# EAGLE design H3BR20 (EAGLE 9.6.2)

## Sheet 1 of 2
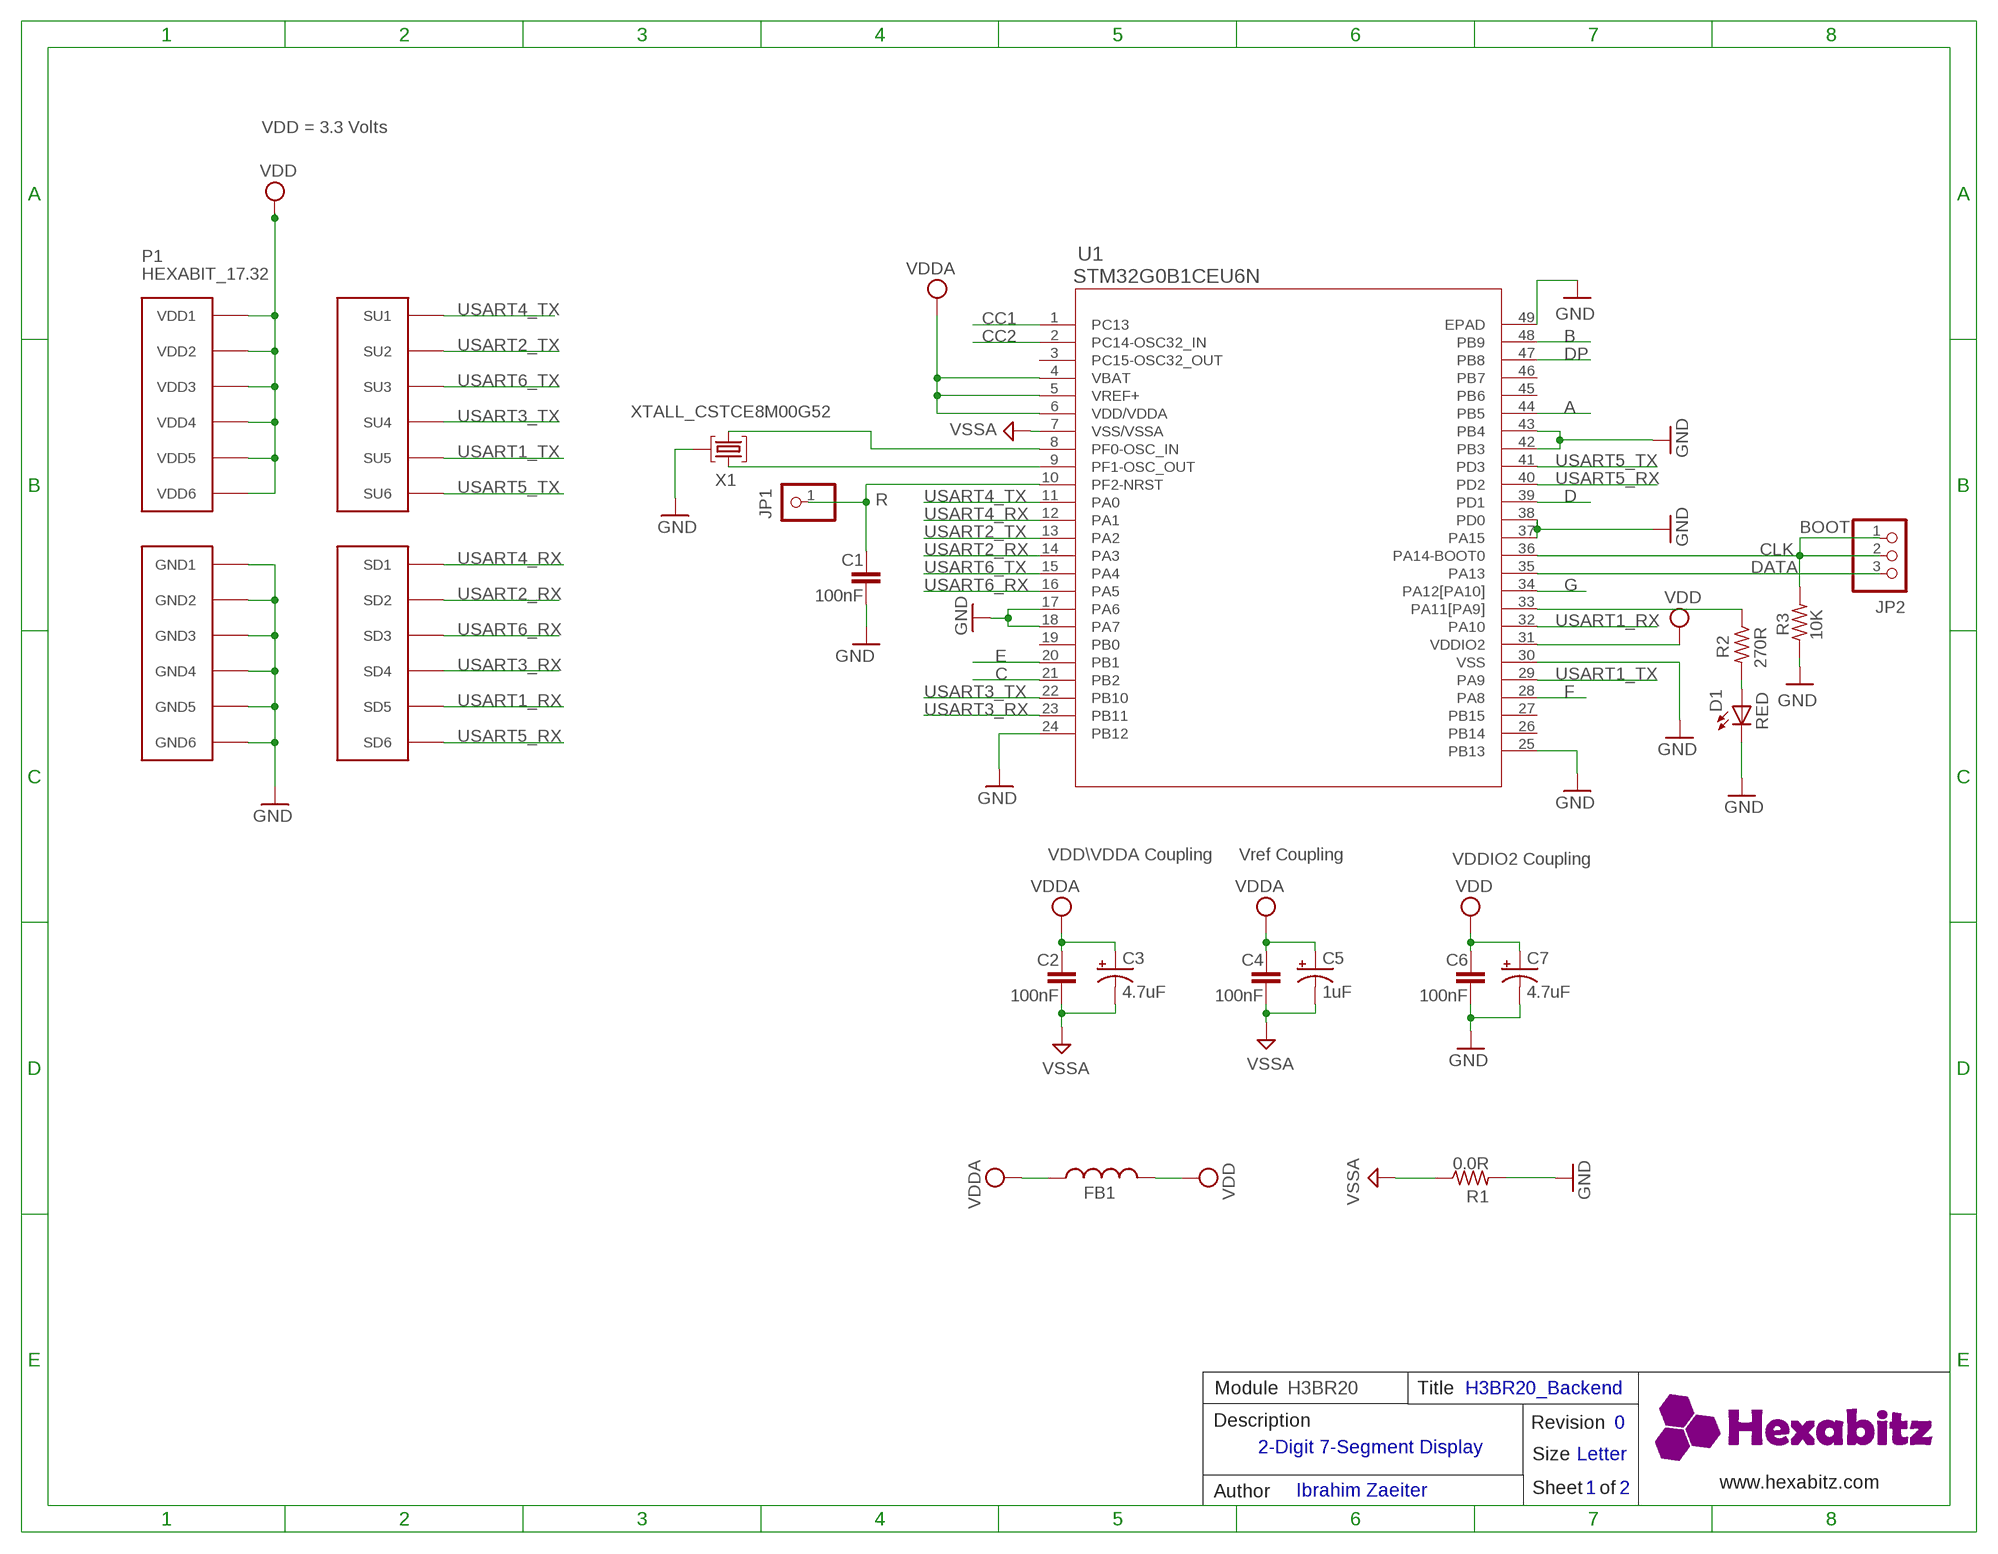
[diagram p0: schematic, sheet 1]

### Parts
C1  100nF  C-0402  [C-0402]
C2  100nF  C-0402  [C-0402]
C3  4.7uF  C-0805-POL  [C-0805-POL]
C4  100nF  C-0402  [C-0402]
C5  1uF  C-0805-POL  [C-0805-POL]
C6  100nF  C-0402  [C-0402]
C7  4.7uF  C-0805-POL  [C-0805-POL]
D1  RED  VLMS1300-GS08  [VLMS1300-GS08]
FB1  FB-0603  [FB-0603]
JP1  R  PINHD-1X1  [1X01]
JP2  PINHD-1X3  [1X03]
P1  HEXABIT_17.32  [HEXABIT_17.32]
R1  0.0R  R-0402  [R-0402]
R2  270R  R-0603  [R-0603]
R3  10K  R-0402  [R-0402]
U1  STM32G0B1CEU6N  [QFN_B1CEU6_STM-L]
X1  XTALL_CSTCE8M00G52  [XTALL_CSTCE8M00G52]

### Nets
A: U1.44(PB5) ; also sheet 2
B: U1.48(PB9) ; also sheet 2
C: U1.21(PB2) ; also sheet 2
CC1: U1.1(PC13) ; also sheet 2
CC2: U1.2(PC14-OSC32_IN) ; also sheet 2
CLK: JP2.1 JP2.2 R3.2 U1.36(PA14-BOOT0)
D: U1.39(PD1) ; also sheet 2
DATA: JP2.3 U1.35(PA13)
DP: U1.47(PB8) ; also sheet 2
E: U1.20(PB1) ; also sheet 2
F: U1.28(PA8) ; also sheet 2
G: U1.34(PA12[PA10]) ; also sheet 2
GND: C1.2 C6.2 C7.2(-) D1.C P1.PAD_PD7(GND1) P1.PAD_PD8(GND2) P1.PAD_PD9(GND3) P1.PAD_PD10(GND4) P1.PAD_PD11(GND5) P1.PAD_PD12(GND6) R1.2 R3.1 U1.17(PA6) U1.18(PA7) U1.24(PB12) U1.25(PB13) U1.30(VSS) U1.37(PA15) U1.38(PD0) U1.42(PB3) U1.43(PB4) U1.49(EPAD) X1.P$2 ; also sheet 2
N$1: D1.A R2.2
N$2: R2.1 U1.33(PA11[PA9])
N$5: U1.9(PF1-OSC_OUT) X1.P$1
N$6: U1.8(PF0-OSC_IN) X1.P$3
N$8: C1.1 JP1.1 U1.10(PF2-NRST)
USART1_RX: P1.PAD_PD5(SD5) U1.32(PA10)
USART1_TX: P1.PAD_PU5(SU5) U1.29(PA9)
USART2_RX: P1.PAD_PD2(SD2) U1.14(PA3)
USART2_TX: P1.PAD_PU2(SU2) U1.13(PA2)
USART3_RX: P1.PAD_PD4(SD4) U1.23(PB11)
USART3_TX: P1.PAD_PU4(SU4) U1.22(PB10)
USART4_RX: P1.PAD_PD1(SD1) U1.12(PA1)
USART4_TX: P1.PAD_PU1(SU1) U1.11(PA0)
USART5_RX: P1.PAD_PD6(SD6) U1.40(PD2)
USART5_TX: P1.PAD_PU6(SU6) U1.41(PD3)
USART6_RX: P1.PAD_PD3(SD3) U1.16(PA5)
USART6_TX: P1.PAD_PU3(SU3) U1.15(PA4)
VDD: C6.1 C7.1(+) FB1.2 P1.PAD_PU7(VDD1) P1.PAD_PU8(VDD2) P1.PAD_PU9(VDD3) P1.PAD_PU10(VDD4) P1.PAD_PU11(VDD5) P1.PAD_PU12(VDD6) U1.31(VDDIO2) ; also sheet 2
VDDA: C2.1 C3.1(+) C4.1 C5.1(+) FB1.1 U1.4(VBAT) U1.5(VREF+) U1.6(VDD/VDDA)
VSSA: C2.2 C3.2(-) C4.2 C5.2(-) R1.1 U1.7(VSS/VSSA)
Unconnected: U1.3(PC15-OSC32_OUT) U1.19(PB0) U1.26(PB14) U1.27(PB15) U1.45(PB6) U1.46(PB7)

### Notes on the sheet
- VDD = 3.3 Volts
- BOOT
- VDD\VDDA Coupling | Vref Coupling | VDDIO2 Coupling
- Module | H3BR20 | Title | H3BR20_Backend
- Description | Revision | 0
- 2-Digit 7-Segment Display
- Size | Letter
- www.hexabitz.com
- Author | Ibrahim Zaeiter | Sheet   of | 1 | 2
- C:/Users/Admin/Desktop/logodraft.bmp

## Sheet 2 of 2
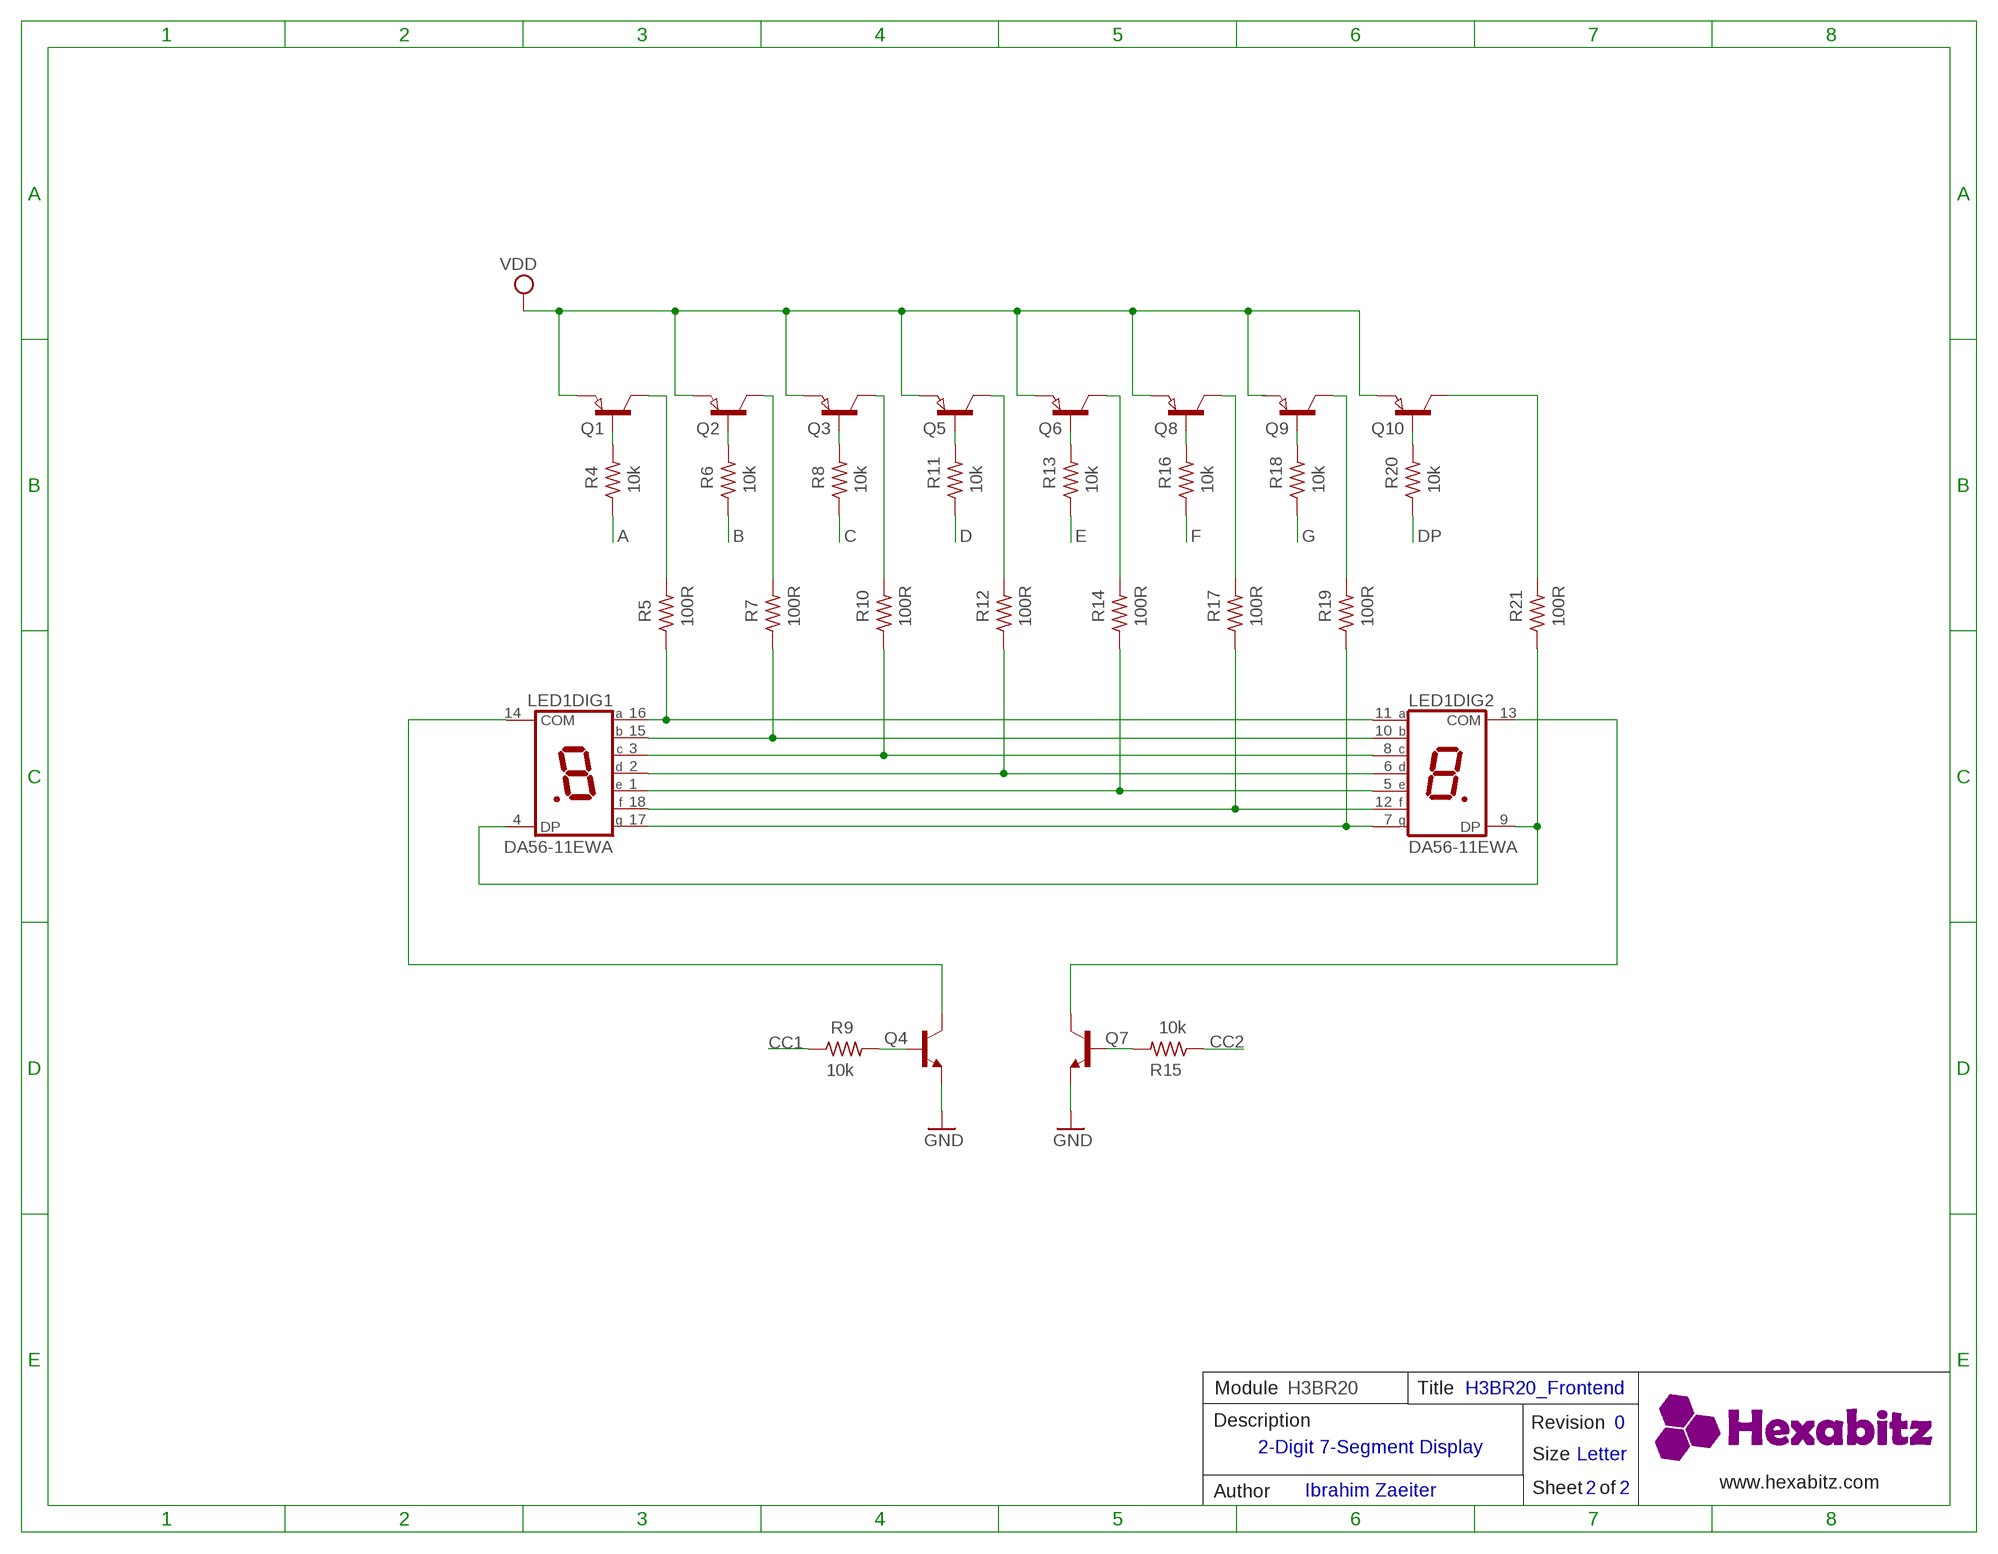
[diagram p1: schematic, sheet 2]

### Parts
LED1  DA56-11EWA  [DA56]
Q1  SEMICON-SMD-IPC_PNP-TRANSISTOR_SOT23  [SEMICON-SMD-IPC_SOT23]
Q2  SEMICON-SMD-IPC_PNP-TRANSISTOR_SOT23  [SEMICON-SMD-IPC_SOT23]
Q3  SEMICON-SMD-IPC_PNP-TRANSISTOR_SOT23  [SEMICON-SMD-IPC_SOT23]
Q4  MMBT3904LT1  [MMBT3904LT1]
Q5  SEMICON-SMD-IPC_PNP-TRANSISTOR_SOT23  [SEMICON-SMD-IPC_SOT23]
Q6  SEMICON-SMD-IPC_PNP-TRANSISTOR_SOT23  [SEMICON-SMD-IPC_SOT23]
Q7  MMBT3904LT1  [MMBT3904LT1]
Q8  SEMICON-SMD-IPC_PNP-TRANSISTOR_SOT23  [SEMICON-SMD-IPC_SOT23]
Q9  SEMICON-SMD-IPC_PNP-TRANSISTOR_SOT23  [SEMICON-SMD-IPC_SOT23]
Q10  SEMICON-SMD-IPC_PNP-TRANSISTOR_SOT23  [SEMICON-SMD-IPC_SOT23]
R4  10k  R-0402  [R-0402]
R5  100R  R-0402  [R-0402]
R6  10k  R-0402  [R-0402]
R7  100R  R-0402  [R-0402]
R8  10k  R-0402  [R-0402]
R9  10k  R-0402  [R-0402]
R10  100R  R-0402  [R-0402]
R11  10k  R-0402  [R-0402]
R12  100R  R-0402  [R-0402]
R13  10k  R-0402  [R-0402]
R14  100R  R-0402  [R-0402]
R15  10k  R-0402  [R-0402]
R16  10k  R-0402  [R-0402]
R17  100R  R-0402  [R-0402]
R18  10k  R-0402  [R-0402]
R19  100R  R-0402  [R-0402]
R20  10k  R-0402  [R-0402]
R21  100R  R-0402  [R-0402]

### Nets
A: R4.1 ; also sheet 1
B: R6.1 ; also sheet 1
C: R8.1 ; also sheet 1
CC1: R9.1 ; also sheet 1
CC2: R15.1 ; also sheet 1
D: R11.1 ; also sheet 1
DP: R20.1 ; also sheet 1
E: R13.1 ; also sheet 1
F: R16.1 ; also sheet 1
G: R18.1 ; also sheet 1
GND: Q4.2(E) Q7.2(E) ; also sheet 1
N$3: LED1.10(DIG2:B) LED1.15(DIG1:B) R7.1
N$4: Q1.1(B) R4.2
N$7: Q2.1(B) R6.2
N$10: Q9.3(C) R19.2
N$11: Q8.3(C) R17.2
N$12: Q6.3(C) R14.2
N$13: Q5.3(C) R12.2
N$14: Q3.3(C) R10.2
N$15: Q2.3(C) R7.2
N$16: Q1.3(C) R5.2
N$25: Q3.1(B) R8.2
N$26: Q5.1(B) R11.2
N$27: Q6.1(B) R13.2
N$28: Q8.1(B) R16.2
N$29: Q9.1(B) R18.2
N$30: Q10.1(B) R20.2
N$31: LED1.11(DIG2:A) LED1.16(DIG1:A) R5.1
N$32: LED1.4(DIG1:DP) LED1.9(DIG2:DP) R21.1
N$33: LED1.3(DIG1:C) LED1.8(DIG2:C) R10.1
N$34: LED1.2(DIG1:D) LED1.6(DIG2:D) R12.1
N$35: LED1.1(DIG1:E) LED1.5(DIG2:E) R14.1
N$36: LED1.12(DIG2:F) LED1.18(DIG1:F) R17.1
N$37: LED1.7(DIG2:G) LED1.17(DIG1:G) R19.1
N$38: LED1.14(DIG1:COM) Q4.3(C)
N$39: LED1.13(DIG2:COM) Q7.3(C)
N$40: Q7.1(B) R15.2
N$41: Q4.1(B) R9.2
N$46: Q10.3(C) R21.2
VDD: Q1.2(E) Q2.2(E) Q3.2(E) Q5.2(E) Q6.2(E) Q8.2(E) Q9.2(E) Q10.2(E) ; also sheet 1

### Notes on the sheet
- Module | H3BR20 | Title | H3BR20_Frontend
- Description | Revision | 0
- 2-Digit 7-Segment Display
- Size | Letter
- www.hexabitz.com
- Author | Ibrahim Zaeiter | Sheet   of | 2 | 2
- C:/Users/Admin/Desktop/logodraft.bmp

## Library data of the parts
C1 C2 C4 C6 = HEXABITZ_RCLS:C-0402: CAP CER 10% 0402
C3 C5 C7 = HEXABITZ_RCLS:C-0805-POL: Cap Tant Solid SMD 2012
D1 = Hexabitz:VLMS1300-GS08: Red 0603 130° Clear 54 mcd 2 V Surface Mount ChipLED ; Octopart Url : http://octopart.com/vlms1300-gs08-vishay-21709201; MFN: Vishay; MPN: VLMS1300-GS08; OCTOPART_URL: https://octopart.com/vlms1300-gs08-vishay-21709201?r=sp&s=_gcP4_q8T1SC6PJQPTQ9yA
FB1 = HEXABITZ_RCLS:FB-0603: Ferrite Beads Multi-Layer 0603
JP1 = HEXABITZ_USER_INTERFACE_PARTS:PINHD-1X1: PIN HEADER; MFN: TE Connectivity; MPN: 87227-1; OCTOPART_URL: https://octopart.com/87227-1-te+connectivity-39512052?r=sp
JP2 = pinhead:PINHD-1X3: PIN HEADER
LED1 = display-kingbright:DA56-11: 14.22mm (0.56INCH) DUAL DIGIT NUMERIC DISPLAYS Source: www.kingbright.com .. DA56-11SRWA.pdf; MF: Lite-On; MPN: LTD-6940HR; OC_FARNELL: unknown; OC_NEWARK: unknown
P1 = hexabitz_connectors:HEXABIT_?: Hexabitz Hexagon Module Connector Hexagon side length = 28.87mm.
Q1-Q3 Q5 Q6 Q8-Q10 = HEXABITZ_RCLS:SEMICON-SMD-IPC_PNP-TRANSISTOR_: PNP TRANSISTOR
Q4 Q7 = HEXABITZ_RCLS:MMBT3904LT1: TRANS NPN 40V 0.2A SOT23; MOUNTING_STYLE: Surface Mount; NUM_OF_PINS: 3; PACKAGE: SOT-23-3; PACKAGING: Reel; PRODUCT_CATEGORY: Transistors Bipolar-BJT; SERIES: MMBT3904L
R1 R3-R21 = HEXABITZ_RCLS:R-0402: Thick Film Resistors - SMD 0603
R2 = HEXABITZ_RCLS:R-0603: Thick Film Resistors - SMD 0603
U1 = HEXABITZ_ICs:STM32G0B1CEU6N
X1 = Hexabitz:XTALL_CSTCE8M00G52: MURATA CSTCE8M00G52-R0 RESONATOR, SMD, 8MHZ ; Octopart Url : https://octopart.com/cstce8m00g52-r0-murata-7145559; MFN: Murata; MPN: CSTCE8M00G52Z-R0; OCTOPART_URL: https://octopart.com/cstce8m00g52z-r0-murata-17755941?r=sp&s=JDnNJnrHQhyS8Zk4ofFWXw

## Board
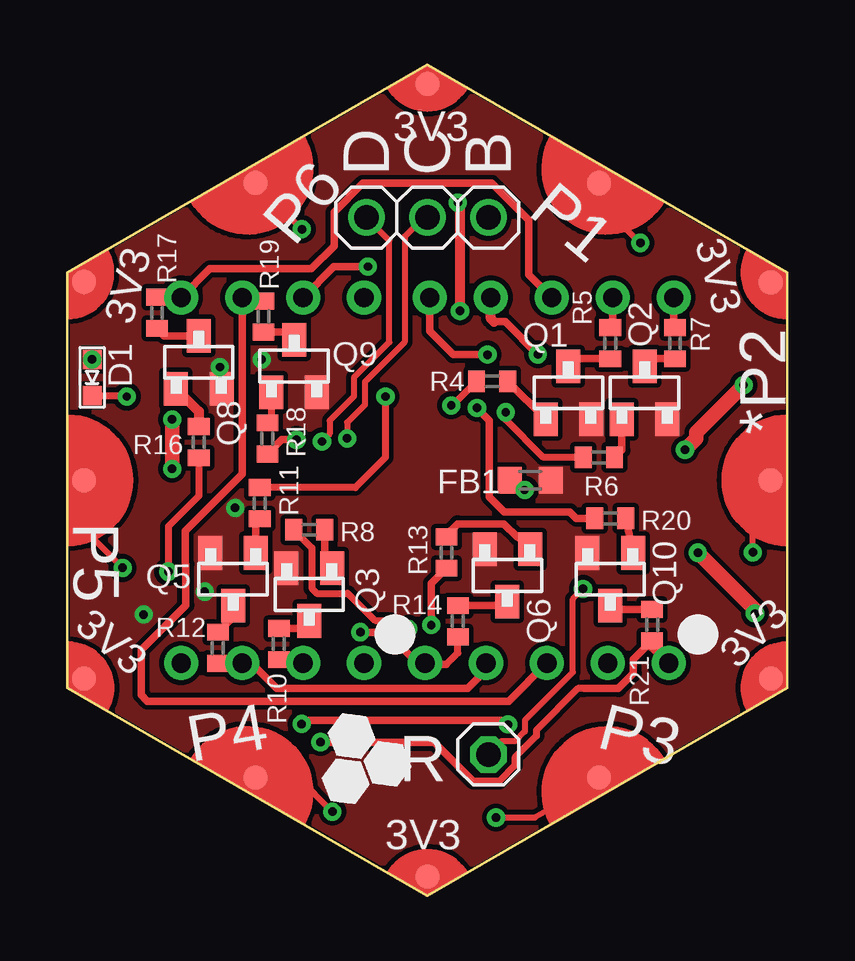
[diagram p2: board, top side]
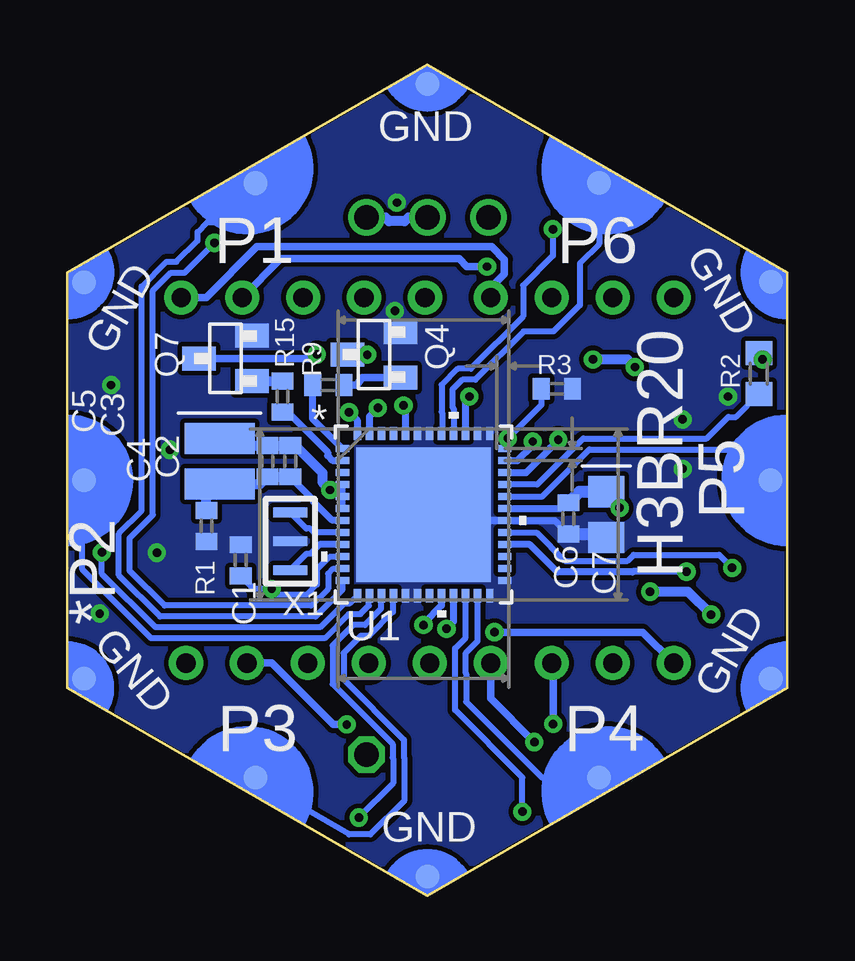
[diagram p3: board, bottom side, seen from below]

Size 30 x 34.64 mm. Coordinates in mm from the lower left corner, seen from the top.
Copper layers (1*16): Top 0.035mm / dielectric 1.5mm / Bottom 0.035mm
Design rules "default *": minimum track width 6mil, minimum drill 0.35mm, track to track 0.19811875mm, track to pad 0.19811875mm, pad to pad 0.19811875mm, via to via 0.19811875mm, smd to smd 0mil, copper to edge 1mil, drill to drill 6mil, minimum pad ring 10mil, minimum via ring 8mil, stop-mask expansion 4mil, vias tented up to drill 24mil, thermal gap 10mil

### Footprints (pad centres in the part's own frame; a part is rotated, then mirrored left to right if it is on the bottom)
C-0402 = smd 0.7 x 0.9: 1 -0.65,0; 2 0.65,0
C-0805-POL = smd 1.3 x 1.5: 1 -0.95,0; 2 0.95,0
VLMS1300-GS08 = smd 0.8 x 0.8: A 0,0.75; C 0,-0.75
FB-0603 = smd 1 x 1.1: 1 -0.85,0; 2 0.85,0
1X01 = drill 1.016 octagon: 1 0,0
1X03 = drill 1.016: 1 -2.54,0; 2 0,0; 3 2.54,0
DA56 = drill 0.8 pad 1.422: 1 -10.26,-7.62; 2 -7.72,-7.62; 3 -5.18,-7.62; 4 -2.64,-7.62; 5 -0.1,-7.62; 6 2.44,-7.62; 7 4.98,-7.62; 8 7.52,-7.62; 9 10.06,-7.62; 10 10.26,7.62; 11 7.72,7.62; 12 5.18,7.62; 13 2.64,7.62; 14 0.1,7.62; 15 -2.64,7.62; 16 -5.18,7.62; 17 -7.72,7.62; 18 -10.26,7.62
HEXABIT_17.32 = smd 1 x 1 bottom: PAD_PD1 12.39,7.15; PAD_PD2 12.39,-7.15; PAD_PD3 0,-14.31; PAD_PD4 -12.39,-7.15; PAD_PD5 -12.39,7.15; PAD_PD6 0,14.31; PAD_PD7 8.26,14.31; PAD_PD8 16.52,0; PAD_PD9 8.26,-14.31; PAD_PD10 -8.26,-14.31; PAD_PD11 -16.52,0; PAD_PD12 -8.26,14.31 | smd 1 x 1: PAD_PU1 12.39,7.15; PAD_PU2 12.39,-7.15; PAD_PU3 0,-14.31; PAD_PU4 -12.39,-7.15; PAD_PU5 -12.39,7.15; PAD_PU6 0,14.31; PAD_PU7 8.26,14.31; PAD_PU8 16.52,0; PAD_PU9 8.26,-14.31; PAD_PU10 -8.26,-14.31; PAD_PU11 -16.52,0; PAD_PU12 -8.26,14.31
SEMICON-SMD-IPC_SOT23 = smd 1 x 1.4: 1 -0.95,-1.1; 2 0.95,-1.1; 3 0,1.1
MMBT3904LT1 = smd 1 x 1.4: 1 -0.95,-1.1; 2 0.95,-1.1; 3 0,1.1
R-0402 = smd 0.7 x 0.9: 1 -0.65,0; 2 0.65,0
R-0603 = smd 1 x 1.1: 1 -0.85,0; 2 0.85,0
QFN_B1CEU6_STM-L = smd 0.55 x 0.3: 1 -3.38,2.751; 2 -3.38,2.251; 3 -3.38,1.75; 4 -3.38,1.25; 5 -3.38,0.75; 6 -3.38,0.25; 7 -3.38,-0.25; 8 -3.38,-0.75; 9 -3.38,-1.25; 10 -3.38,-1.75; 11 -3.38,-2.251; 12 -3.38,-2.751; 25 3.38,-2.751; 26 3.38,-2.251; 27 3.38,-1.75; 28 3.38,-1.25; 29 3.38,-0.75; 30 3.38,-0.25; 31 3.38,0.25; 32 3.38,0.75; 33 3.38,1.25; 34 3.38,1.75; 35 3.38,2.251; 36 3.38,2.751 | smd 0.3 x 0.55: 13 -2.751,-3.38; 14 -2.251,-3.38; 15 -1.75,-3.38; 16 -1.25,-3.38; 17 -0.75,-3.38; 18 -0.25,-3.38; 19 0.25,-3.38; 20 0.75,-3.38; 21 1.25,-3.38; 22 1.75,-3.38; 23 2.251,-3.38; 24 2.751,-3.38; 37 2.751,3.38; 38 2.251,3.38; 39 1.75,3.38; 40 1.25,3.38; 41 0.75,3.38; 42 0.25,3.38; 43 -0.25,3.38; 44 -0.75,3.38; 45 -1.25,3.38; 46 -1.75,3.38; 47 -2.251,3.38; 48 -2.751,3.38 | smd 5.6 x 5.6: 49 0,0
XTALL_CSTCE8M00G52 = smd 1.4 x 0.4: P$1 0,1.2; P$2 0,0; P$3 0,-1.2

### Placement (x,y rotation side)
C1  22.78,13.99 90 bottom
C2  20.71,18.11 270 bottom
C3  22.94,18.11 270 bottom
C4  21.67,18.11 270 bottom
C5  24.37,18.11 270 bottom
C6  9.13,15.73 270 bottom
C7  7.54,15.89 270 bottom
D1  1.03,21.61 0 top
FB1  19.29,17.32 0 top
JP1  17.54,5.89 0 top
JP2  15,28.27 180 top
LED1  15,17.32 0 top
P1  15,17.32 30 top
Q1  20.87,20.97 0 top
Q2  24.05,20.97 0 top
Q3  10.08,12.56 180 top
Q4  17.22,22.56 90 bottom
Q5  6.9,13.19 180 top
Q6  18.33,13.35 180 top
Q7  23.41,22.4 90 bottom
Q8  5.47,22.24 0 top
Q9  9.44,22.08 0 top
Q10  22.62,13.19 180 top
R1  24.21,15.42 270 bottom
R2  1.19,21.77 90 bottom
R3  9.6,21.13 180 bottom
R4  17.7,21.45 0 top
R5  22.62,23.04 270 top
R6  22.14,18.27 0 top
R7  25.32,23.04 270 top
R8  10.08,15.26 0 top
R9  19.13,21.29 0 bottom
R10  8.81,10.49 90 top
R11  8.01,16.37 270 top
R12  6.27,10.34 90 top
R13  15.79,14.3 90 top
R14  16.27,11.45 90 top
R15  21.03,20.81 90 bottom
R16  5.47,18.91 90 top
R17  3.73,24.31 270 top
R18  8.33,19.07 90 top
R19  8.17,24.15 270 top
R20  22.62,15.73 0 top
R21  24.37,11.29 90 top
U1  15.16,15.89 0 bottom
X1  20.71,14.78 180 bottom

### Tracks (layer width: path | path; a pad name or v marks a point on that pad's centre or on a via)
A  (via drill 0.35)
  Top 0.292: R4.1 16.04,20.44 v15.99,20.44
  Bottom 0.292: U1.44 15.91,20.35 v15.99,20.44
B  (via drill 0.35)
  Top 0.292: R6.1 19.84,18.27 18.26,19.84 v18.26,20.16
  Bottom 0.292: U1.48 17.91,19.8 v18.26,20.16
C  (via drill 0.35)
  Top 0.292: v14.21,11.13 13.86,11.13 13.5,11.48 12.81,11.48 11.68,12.61 10.39,12.61 10.18,12.82 10.18,14.5 R8.1
  Bottom 0.292: v14.21,11.13 13.91,11.43 U1.21
CC1
  Bottom 0.292: U1.1 19.78,19.88 R9.1
CC2
  Bottom 0.292: U1.2 18.96,18.15 19.16,18.35 19.16,18.49 20.83,20.16 R15.1
CLK  (via drill 0.35)
  Top 0.254: v11.65,19.07 11.65,19.73 12.39,20.47 12.39,21.42 14.05,23.08 14.05,27.48 14.84,28.27 JP2.2
  Bottom 0.254: R3.2 10.25,20.47 v11.65,19.07 11.5,18.92 U1.36
  Bottom 0.406: JP2.2 15.79,28.27 15.95,28.12 16.59,28.12 16.75,28.27 JP2.1
D  (via drill 0.35)
  Top 0.292: v13.25,20.81 13.25,18.27 12,17.02 R11.1
  Bottom 0.292: U1.39 13.41,20.66 v13.25,20.81
DATA  (via drill 0.35)
  Top 0.254: v10.61,18.94 10.93,19.26 10.93,19.8 11.94,20.81 11.94,21.61 13.41,23.08 13.41,27.32 JP2.3
  Bottom 0.3: U1.35 11.25,18.14 10.61,18.78 v10.61,18.94
DP  (via drill 0.35)
  Top 0.305: v17.06,20.34 17.59,19.81 17.59,16.63 18.21,16 20.94,16 21.21,15.73 R20.1
  Bottom 0.292: U1.47 17.41,19.99 v17.06,20.34
E  (via drill 0.35)
  Top 0.305: R13.1 15.16,13.02 v15.16,11.29
  Bottom 0.292: U1.20 14.41,12.09 15.16,11.35 v15.16,11.29
F  (via drill 0.35)
  Top 0.292: R16.1 5.47,16.67 4.2,15.4 v4.2,13.51
  Bottom 0.292: v4.2,13.51 6.44,13.51 6.46,13.5 9.59,13.5 10.73,14.64 U1.28
G  (via drill 0.35)
  Top 0.305: R18.1 8.93,19.01 v9.55,19.01
  Bottom 0.292: v9.55,19.01 9.89,18.67 9.89,18.64 10.88,17.64 U1.34
GND  (via drill 0.35)
  Top 0.292: D1.C 2.43,20.86 v2.47,20.81
  Top 0.406: v16.27,28.9 16.36,28.81 v16.36,24.38
  Top 0.61: v28.65,11.76 28.65,11.92 v26.27,14.3 | v4.36,19.86 v4.36,17.8 | v28.18,21.29 26.21,19.32 26.21,19.07 v25.73,18.59
  Bottom 0.292: U1.30 9.68,15.64 C6.2
  Bottom 0.305: U1.30 14.91,15.64 U1.49
  Bottom 0.406: 16.21,23.6 Q4.2
  Bottom 0.508: C6.2 8.03,15.08 7.86,15.26
  Bottom 0.61: 7.86,15.26 C7.2
  pour Bottom (no thermals): 0.24,26.21 15.16,34.78 30.08,26.21 30.08,8.91 15.16,0.18 0.24,8.75
N$1  (via drill 0.35)
  Bottom 0.305: R2.2 1.19,22.52 D1.A
  other vias: 1.03,22.36
N$2
  Bottom 0.254: R2.1 2.14,19.96 2.46,19.96 3.35,19.07 8.5,19.07 10.42,17.14 U1.33
N$3
  Top 0.305: R7.1 25.26,23.74 LED1.10
  Bottom 0.305: LED1.10 24.22,24.94 22.1,27.06 12.32,27.06 11.79,26.53 11.79,25.93 12.36,25.36 LED1.15
N$4
  Top 0.305: Q1.1 R4.2
N$5
  Bottom 0.254: X1.P$1 20.04,14.26 19.88,14.26 19.49,14.64
  Bottom 0.292: U1.9 19.49,14.64
N$6
  Bottom 0.254: U1.8 19.72,15.14 19.88,15.31 20.04,15.31 X1.P$3
N$7
  Top 0.305: R6.2 23.1,18.58 Q2.1
N$8  (via drill 0.35)
  Top 0.254: v21.48,12.8 21.06,12.37 21.06,9.31 19.06,7.32 19.06,6.85 18.65,6.44 18.09,6.44 JP1.1
  Bottom 0.254: U1.10 18.56,14.12 19.09,14.12 19.6,13.6 19.6,12.97 20.03,12.55 21.42,12.55 21.67,12.8 | v21.48,12.8 21.67,12.8 | 21.67,12.8 22.24,12.8 C1.1
N$10
  Top 0.305: R19.2 9.13,23.5 Q9.3
N$11
  Top 0.305: Q8.3 4.04,23.34 R17.2
N$12
  Top 0.305: Q6.3 18.18,12.1 R14.2
N$13
  Top 0.305: R12.2 6.9,11.62 Q5.3
N$14
  Top 0.305: R10.2 9.76,11.14 Q3.3
N$15
  Top 0.305: Q2.3 24.36,22.39 R7.2
N$16
  Top 0.305: Q1.3 21.19,22.39 R5.2
N$25
  Top 0.305: Q3.1 10.73,13.96 R8.2
N$26
  Top 0.305: Q5.1 7.85,15.56 R11.2
N$27
  Top 0.305: Q6.1 18.78,14.95 18.74,14.95 18.19,15.5 16.26,15.5 15.79,15.03 R13.2
N$28
  Top 0.406: Q8.1 5.47,20.19 R16.2
N$29
  Top 0.292: Q9.1 8.49,19.88 R18.2
N$30
  Top 0.305: R20.2 Q10.1
N$31  (via drill 0.35)
  Top 0.305: LED1.16 11.11,26.23 v12.52,26.23 | LED1.11 22.72,23.79 R5.1
  Bottom 0.305: v12.52,26.23 13.35,26.23 13.68,26.55 21.11,26.55 LED1.11
N$32  (via drill 0.35)
  Top 0.292: 21.53,8.64 21.27,8.64 19.54,6.9 19.54,6.66 18.65,5.77 18.65,5.43 17.99,4.78 16.92,4.78
  Top 0.305: 16.92,4.78 15.29,6.4 v10.54,6.4 | R21.1 23.58,9.85 23.58,9.26 22.96,8.64 21.53,8.64
  Top 0.406: R21.1 24.37,10.39 LED1.9
  Bottom 0.305: LED1.4 12.36,8.22 v10.54,6.4
N$33  (via drill 0.35)
  Top 0.305: v18.36,7.14 18.18,7.32 9.92,7.32 v9.76,7.16 | R10.1 9.68,9.84 LED1.3
  Bottom 0.305: v9.76,7.16 9.76,9.64 LED1.3 | v18.36,7.14 18.92,7.14 21.48,9.7 LED1.8
N$34
  Top 0.305: LED1.6 17.44,9.4 16.68,8.64 8.72,8.64 7.66,9.7 LED1.2 7.26,9.69 R12.1
N$35  (via drill 0.35)
  Top 0.292: 15.79,9.64 16.27,10.12 R14.1
  Top 0.305: 15.79,9.64 14.96,9.64 LED1.5 14.59,9.7 13.3,10.99 v12.2,10.99
  Bottom 0.305: LED1.1 6.03,10.99 v12.2,10.99
N$36
  Top 0.305: LED1.12 19.23,25.89 19.23,28.16 17.68,29.7 12.31,29.7 11.11,28.5 11.11,27.09 10.15,26.14 5.94,26.14 LED1.18 4.72,24.96 R17.1
N$37
  Top 0.305: LED1.7 18.39,8.11 3.33,8.11 3.07,8.38 3.07,10.24 4.93,12.11 4.93,13.81 4.9,13.84 4.9,15.2 7.28,17.58 LED1.17 8.03,24.94 R19.1
N$38  (via drill 0.35)
  Top 0.305: v17.5,22.56 16.08,22.56 15.1,23.54 LED1.14
  Bottom 0.305: Q4.3 v17.5,22.56
N$39  (via drill 0.35)
  Top 0.305: v19.6,22.57 18.24,23.93 17.77,23.93
  Top 0.406: 17.77,23.93 17.64,24.06 LED1.13
  Bottom 0.305: Q7.3 19.77,22.4 v19.6,22.57
N$40
  Bottom 0.406: Q7.1 21.04,21.45 R15.2
N$41
  Bottom 0.305: Q4.1 17.71,21.61 17.94,21.29 R9.2
N$46
  Top 0.305: Q10.3 22.77,11.94 R21.2
USART1_RX
  Bottom 0.254: U1.32 10.21,16.64 8.25,18.61 2.16,18.61 0.87,17.32 | 2.3,18.61 1.01,17.32 0.87,17.32 | 0.87,17.32 P1.PAD_PD5
USART1_TX  (via drill 0.35)
  Top 0.254: v2.3,13.67 0.69,15.27 P1.PAD_PU5
  Bottom 0.254: U1.29 10.44,15.14 9.27,13.97 6.65,13.97 6.41,14.21 2.84,14.21 v2.3,13.67
USART2_RX
  Bottom 0.254: U1.14 17.43,12.49 17.43,12.1 17.8,11.74 18.28,11.74 19.28,10.74 26.51,10.74 29.38,13.6 29.38,17.25 | 29.53,17.1 29.38,17.25 | 29.38,17.25 P1.PAD_PD2
USART2_TX  (via drill 0.35)
  Top 0.254: P1.PAD_PU2 29.06,17.07 28.72,16.74 28.56,16.58 v28.56,14.32
  Bottom 0.254: U1.13 18.23,12.19 18.46,12.19 19.47,11.19 26.33,11.19 28.56,13.42 v28.56,14.32
USART3_RX
  Bottom 0.254: U1.23 12.91,10.62 13.4,10.13 13.4,9.27 13.38,9.26 13.38,8.09 10.23,4.93 P1.PAD_PD4
USART3_TX  (via drill 0.35)
  Top 0.254: P1.PAD_PU4 9.61,4.93 v11.04,3.5
  Bottom 0.254: v11.04,3.5 11.04,4.93 13.85,7.74 13.85,10.32 13.41,10.76 U1.22
USART4_RX
  Bottom 0.254: P1.PAD_PD1 23.78,28.08 24.16,28.08 24.57,27.67 24.57,27.31 25.46,26.43 25.88,26.43 26.91,25.4 26.91,16.05 27.86,15.1 27.86,13.36 26.14,11.64 19.65,11.64 18.54,12.76 U1.12
USART4_TX  (via drill 0.35)
  Top 0.254: v23.87,27.22 22.15,28.93 P1.PAD_PU1
  Bottom 0.254: v23.87,27.22 25.11,25.98 25.69,25.98 26.44,25.23 26.44,15.88 27.41,14.91 27.41,13.55 25.95,12.09 19.84,12.09 19.14,12.8 19.14,13.43 18.95,13.62 18.56,13.62 U1.11
USART5_RX
  Bottom 0.254: P1.PAD_PD6 7.84,27.17 8.65,26.37 8.65,24.62 9.75,23.52 10.99,23.52 13,21.52 13.54,21.52 13.96,21.1 13.96,20.36 13.91,20.31 U1.40
USART5_TX  (via drill 0.35)
  Top 0.254: P1.PAD_PU6 v9.77,27.79
  Bottom 0.254: U1.41 14.38,19.3 14.38,20.15 14.41,20.18 14.41,21.29 13.73,21.97 13.19,21.97 11.01,24.15 11.01,25.44 9.77,26.68 v9.77,27.79
USART6_RX
  Bottom 0.254: U1.16 16.43,12.49 16.43,11.82 17.42,10.84 17.77,10.84 18.49,10.11 18.49,9.02 15.98,6.5 15.98,5.76 15.95,5.73 15.95,3.99 17.38,2.56 18.26,2.56 21.86,4.64 P1.PAD_PD3
USART6_TX  (via drill 0.35)
  Top 0.254: v17.86,3.26 19.48,3.26 21.86,4.64 P1.PAD_PU3
  Bottom 0.254: U1.15 16.93,12.49 16.93,11.96 17.61,11.29 18.09,11.29 18.94,10.43 18.94,8.83 16.45,6.34 16.45,5.76 16.43,5.73 16.43,4.69 v17.86,3.26
VDD  (via drill 0.35)
  Top 0.305: 17.59,14.45 Q6.2
  Bottom 0.292: U1.31 9.37,16.14 C6.1
  Bottom 0.406: C7.1 6.99,16.29 v6.99,16.17 | v3.18,11.72 4.13,12.68 v5.72,12.68 | v6.35,22.04 6.67,22.36 v8.1,22.36
  Bottom 0.508: C7.1 8.67,16.84 C6.1
  pour Top (no thermals): 0.24,26.21 15.16,34.78 30.08,26.21 30.08,8.91 15.16,0.18 0.24,8.75
VDDA  (via drill 0.35)
  Top 0.406: v19.05,16.92 18.84,16.92 FB1.1
  Bottom 0.292: U1.6 U1.5 U1.4
  Bottom 0.406: U1.5 18.81,16.92 v19.05,16.92 19.37,17.23 19.37,17.64 20.42,18.69 20.64,18.69 C2.1 C4.1 22.64,18.76 C3.1 C5.1
VSSA
  Bottom 0.292: U1.7 18.96,15.65 19.78,16.47 19.78,16.53 C2.2
  Bottom 0.406: C2.2 C4.2 21.97,17.16 C3.2 C5.2 24.21,17.01 R1.1

### Text on the board
tPlace: 3V3 | D | C | P1 | 3V3 | P6 | 3V3 | *P2 | P5 | 3V3 | 3V3 | R | P4 | P3 | 3V3
bPlace: H3BR20
tNames: B
bNames: GND | GND | P6 | P1 | GND | P5 | GND | *P2 | GND | P4 | P3 | GND